# Altium schematic sheet LM331vs6N137.SchDoc
size A; PageSetup: Record=PageOptions|CenterHorizontal=True|CenterVertical=True|PrintScale=1.05|XCorrection=1.00|YCorrection=1.00|PrintKind=1|BorderSize=5000000|LeftOffset=0|BottomOffset=0|Orientation=2|PaperLength=1000|PaperWidth=1000|Scale=100|PaperSource=262|PrintQuality=-1|MediaType=1|DitherType=10|PrintScaleMode=1|PaperKind=Letter|PaperIndex=1
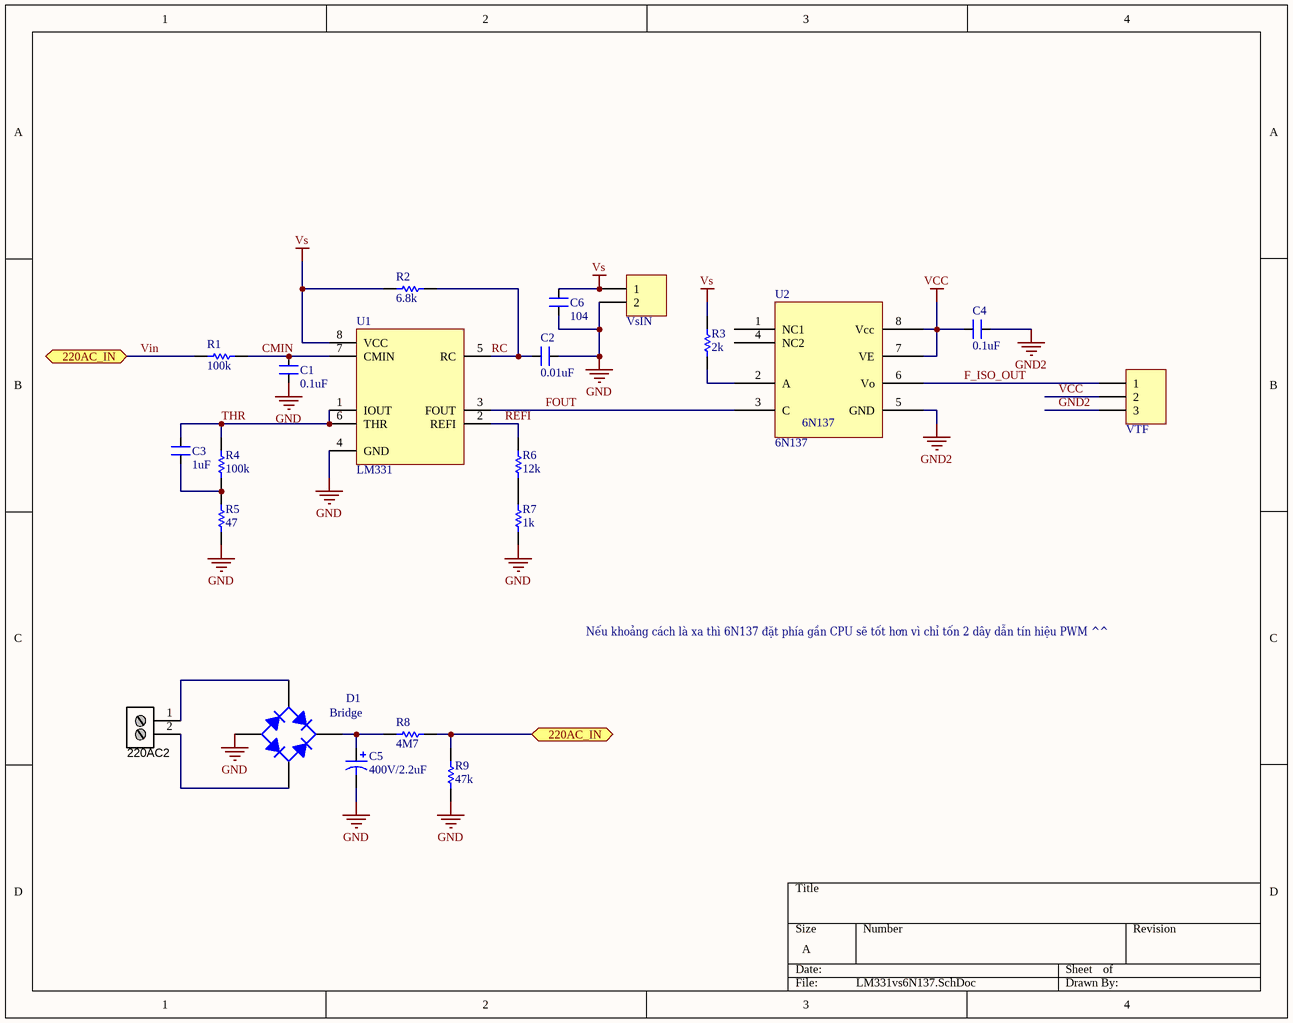
[diagram p0: LM331vs6N137.SchDoc]

## Parts
220AC2  Stackable ScrewTerm  [2P_PCB_ScrewTerm_200mil]  (value not drawn)
C1  value 0.1uF  [CAPC2012N_F]  (hidden comment: CAP NP)
C2  value 0.01uF  [CAPC2012N_F]  (hidden comment: CAP NP)
C3  value 1uF  [CAPC2012N_F]  (hidden comment: CAP NP)
C4  value 0.1uF  [CAPC2012N_F]  (hidden comment: CAP NP)
C5  value 400V/2.2uF  [CAP 3.8mm]  (hidden comment: Cap)
C6  value 104  [CAPC2012N_F]  (hidden comment: CAP NP)
D1  Bridge  [MB6S]
R1  value 100k  [RESC2012N_F]  (hidden comment: Res)
R2  value 6.8k  [RESC2012N_F]  (hidden comment: Res)
R3  value 2k  [RESC2012N_F]  (hidden comment: Res)
R4  value 100k  [RESC2012N_F]  (hidden comment: Res)
R5  value 47  [RESC2012N_F]  (hidden comment: Res)
R6  value 12k  [RESC2012N_F]  (hidden comment: Res)
R7  value 1k  [RESC2012N_F]  (hidden comment: Res)
R8  value 4M7  [RESTH_0.0R_AXIAL-0.6]  (hidden comment: Res)
R9  value 47k  [RESTH_0.0R_AXIAL-0.6]  (hidden comment: Res)
U1  LM331  [DIP8-300]
U2  6N137  [SMD-8]
VsIN  Header 2  [HDR1X2]  (value not drawn)
VTF  Header 3  [HDR1X3]  (value not drawn)

## Ports
220AC_IN

## Nets
GND: C1.1 C2.1 C5.2 C6.1 D1.3(A) R5.1 R7.1 R9.1 U1.4(GND) VsIN.2
GND2: C4.1 U2.5(GND) VTF.3
VCC: C4.2 U2.7(VE) U2.8(Vcc) VTF.2
Vs: C6.2 R2.1 R3.2 U1.8(VCC) VsIN.1
CMIN: C1.2 R1.2 U1.7(CMIN)
F_ISO_OUT: U2.6(Vo) VTF.1
FOUT: U1.3(FOUT) U2.3(C)
RC: C2.2 R2.2 U1.5(RC)
REFI: R6.2 U1.2(REFI)
THR: C3.1 R4.2 U1.1(IOUT) U1.6(THR)
Vin: R1.1 R8.2 R9.2 ; port 220AC_IN
Net220AC2_1: 220AC2.1 D1.4(C)
Net220AC2_2: 220AC2.2 D1.2(C)
NetC3_2: C3.2 R4.1 R5.2
NetC5_1: C5.1 D1.1(K) R8.1
NetR3_1: R3.1 U2.2(A)
NetR6_1: R6.1 R7.2

Not connected (* = marked no-connect by the designer): U2 1(NC1) 4(NC2)

## Notes on the sheet
- Nếu khoảng cách là xa thì 6N137 đặt phía gần CPU sẽ tốt hơn vì chỉ tốn 2 dây dẫn tín hiệu PWM ^^

## Library data of the parts
220AC2 = 2P_ScrewTerm_90S_3.81MM: Terminal Block Screw Type THT 2-Position 3.81mm pitch; Manufacturer 1: Tyco Electronics; Manufacturer Part Number 1: 1776113-2; Value: 2 position; Pitch: 0.150" (3.81mm); Positions Per Level: 2; Package / Case: Side Entry; 3.81mm pitch; Category: Connectors Interconnects; Color: Black; Supplier 1: Digi-Key; Supplier Part Number 1: A97976-ND
D1 = Bridge1: Full Wave Diode Bridge; pin to pad: 2>3 3>4 4>2; Published: 8-Jun-2000; LatestRevisionDate: 29-May-2009; LatestRevisionNote: Sch pins A & K swapped.; DatasheetVersion: E2732B; PackageReference: D-38; Publisher: Altium Limited; PackageDescription: Bridge Rectifier; 4 Terminals; Body 9.4 x 9.4 mm (typ); Pitch 5.08 mm
VsIN = Header 2: Header, 2-Pin; LatestRevisionDate: 17-Jul-2002; LatestRevisionNote: Re-released for DXP Platform.; Publisher: Altium Limited
VTF = Header 3: Header, 3-Pin; LatestRevisionDate: 17-Jul-2002; LatestRevisionNote: Re-released for DXP Platform.; Publisher: Altium Limited